# EAGLE design xbee_breakout (EAGLE 9.5.1)
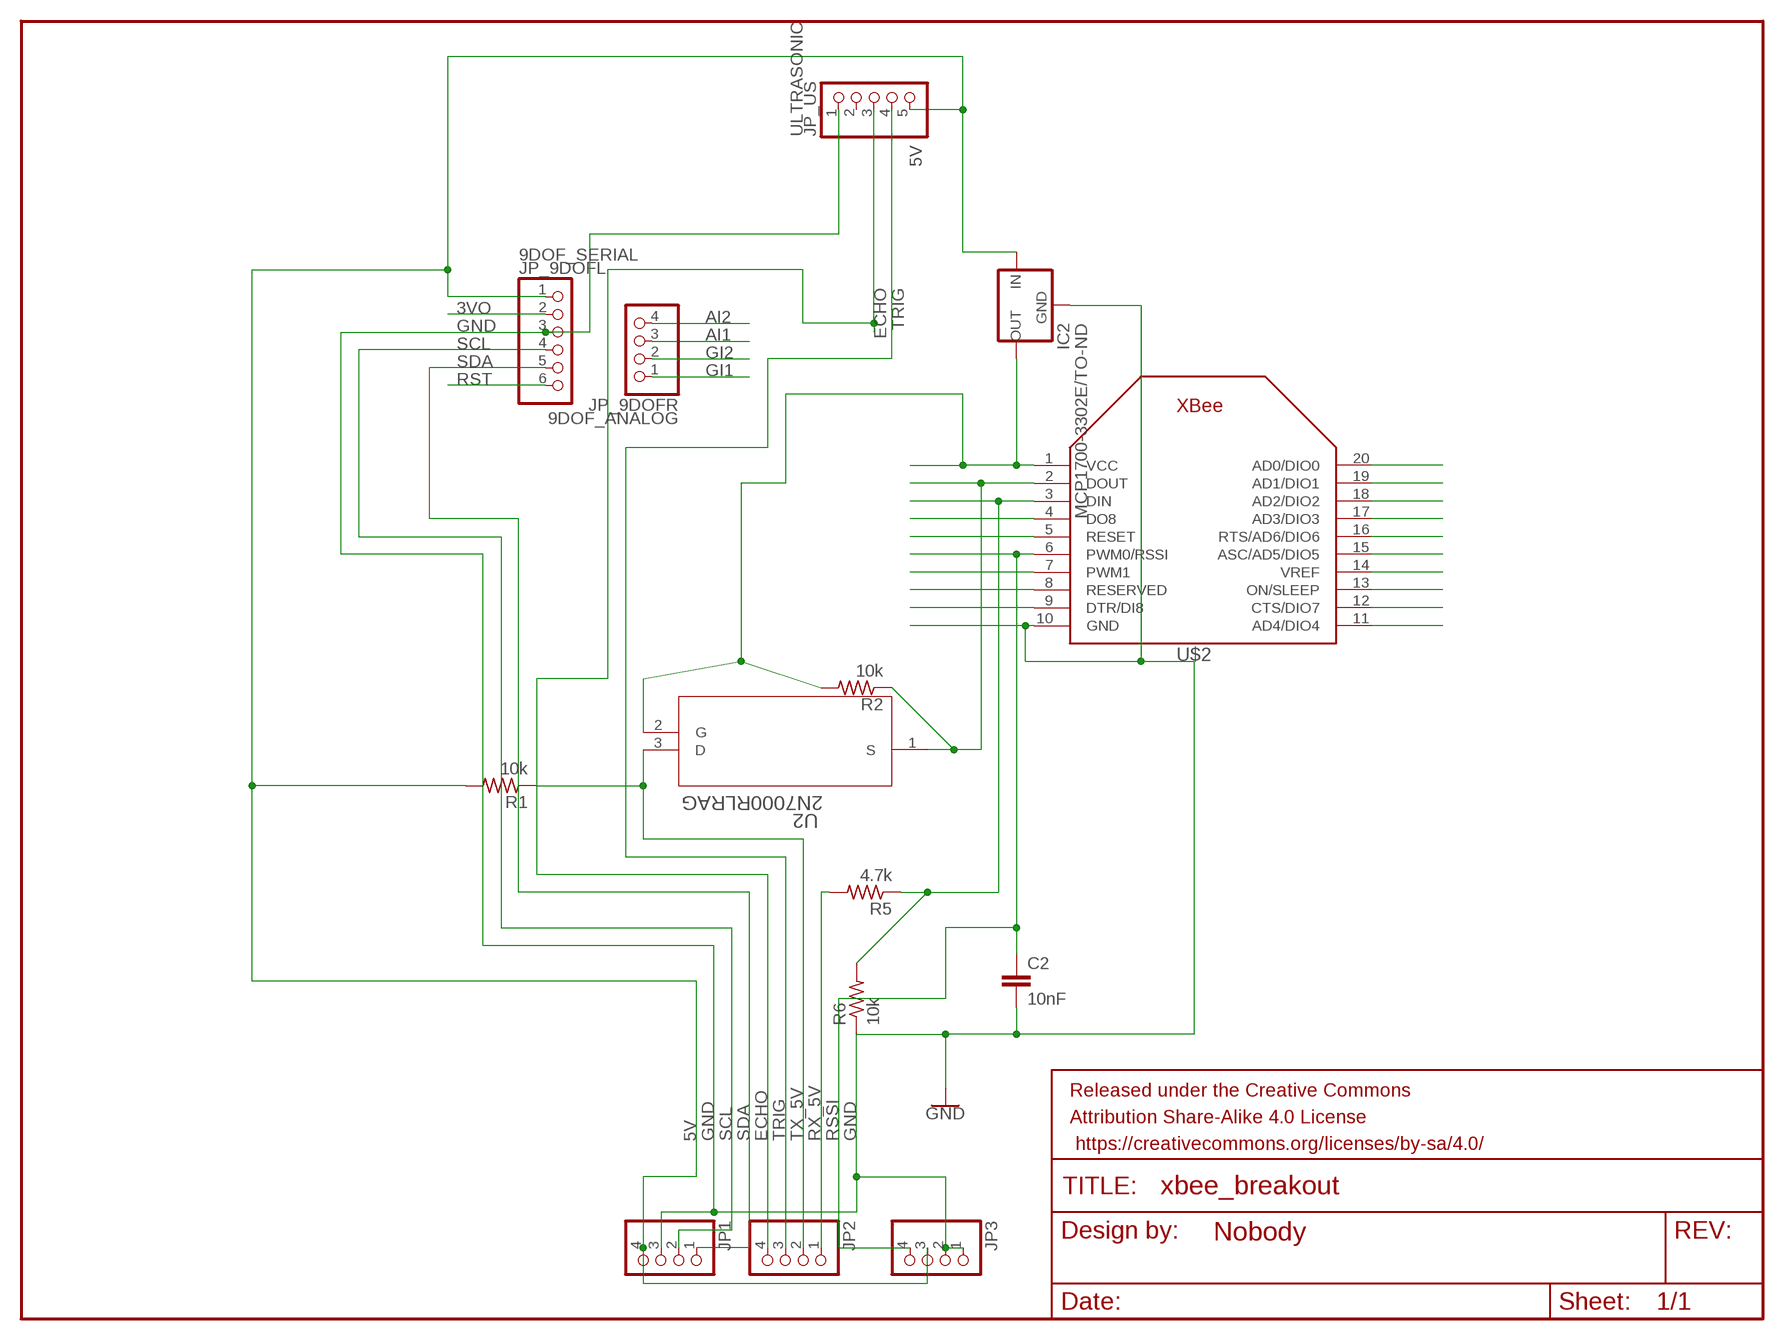
[diagram p0: schematic, sheet 1]

## Parts
C2  10nF  10NF-PTH-10MM-10000V-1-%  [CAP-PTH-10MM]
FRAME1  FRAME-LETTERNO_PACKAGE  [DUMMY]
IC2  MCP1700-3302E/TO-ND  MCP1700INLINE  [TO92-INLINE]
JP1  PINHD-1X4  [1X04]
JP2  PINHD-1X4  [1X04]
JP3  PINHD-1X4  [1X04]
JP_9DOFL  PINHD-1X6  [1X06]
JP_9DOFR  PINHD-1X4  [1X04]
JP_US  PINHD-1X5  [1X05]
R1  10k  R-US_0207/12  [0207/12]
R2  10k  R-US_0207/12  [0207/12]
R5  4.7k  R-US_0207/12  [0207/12]
R6  10k  R-US_0207/12  [0207/12]
U2  2N7000RLRAG  [TO-92]
U$2  XBEE  [XBEE]

## Nets
3VO: JP_9DOFL.2
5V: IC2.2(IN) JP1.4 JP3.3 JP_9DOFL.1 JP_US.5 R1.2
AI1: JP_9DOFR.3
AI2: JP_9DOFR.4
DIN: R5.1 R6.2 U$2.3(DIN)
DOUT: R2.1 U2.1(S) U$2.2(DOUT)
ECHO: JP2.4 JP_US.3
GI1: JP_9DOFR.1
GI2: JP_9DOFR.2
GND: C2.2 IC2.1(GND) JP1.3 JP3.1 JP3.2 JP_9DOFL.3 JP_US.1 R6.1 U$2.10(GND)
N$2: U$2.8(RESERVED)
N$29: U$2.20(AD0/DIO0)
N$37: U$2.19(AD1/DIO1)
N$38: U$2.18(AD2/DIO2)
N$39: U$2.17(AD3/DIO3)
N$40: U$2.16(RTS/AD6/DIO6)
N$41: U$2.15(ASC/AD5/DIO5)
N$42: U$2.14(VREF)
N$43: U$2.13(ON/SLEEP)
N$44: U$2.12(CTS/DIO7)
N$45: U$2.11(AD4/DIO4)
N$46: U$2.9(DTR/DI8)
N$47: U$2.7(PWM1)
N$49: U$2.5(RESET)
N$50: U$2.4(DO8)
RSSI: C2.1 JP3.4 U$2.6(PWM0/RSSI)
RST: JP_9DOFL.6
RX_5V: JP2.1 R5.2
SCL: JP1.2 JP_9DOFL.4
SDA: JP1.1 JP_9DOFL.5
TRIG: JP2.3 JP_US.4
TX_5V: JP2.2 R1.1 U2.3(D)
VCC: IC2.3(OUT) R2.2 U2.2(G) U$2.1(VCC)
Unconnected: JP_US.2

## Library data of the parts
C2 = SparkFun-Capacitors:10NF: 0.01uF/10nF/10,000pF ceramic capacitors A capacitor is a passive two-terminal electrical component used to store electrical energy temporarily in an electric field. CAP-09321; PROD_ID: CAP-09321
FRAME1 = SparkFun-Aesthetics:FRAME-LETTER: Schematic Frame - Letter Standard 8.5x11 US Letter frame; DESIGNER: Nobody; VERSION: v01
IC2 = adafruit:MCP1700: VOLTAGE REGULATOR
JP1-JP3 JP_9DOFR = pinhead:PINHD-1X4: PIN HEADER
JP_9DOFL = pinhead:PINHD-1X6: PIN HEADER
JP_US = pinhead:PINHD-1X5: PIN HEADER
R1 R2 R5 R6 = resistor:R-US_: RESISTOR, American symbol
U2 = 2N7000RLRAG:2N7000RLRAG; BUILT_BY: EMA_UL_Team; MANUFACTURER_PART_NUMBER: 2N7000RLRAG; VENDOR: ON Semiconductor
U$2 = adafruit:XBEE

## Board
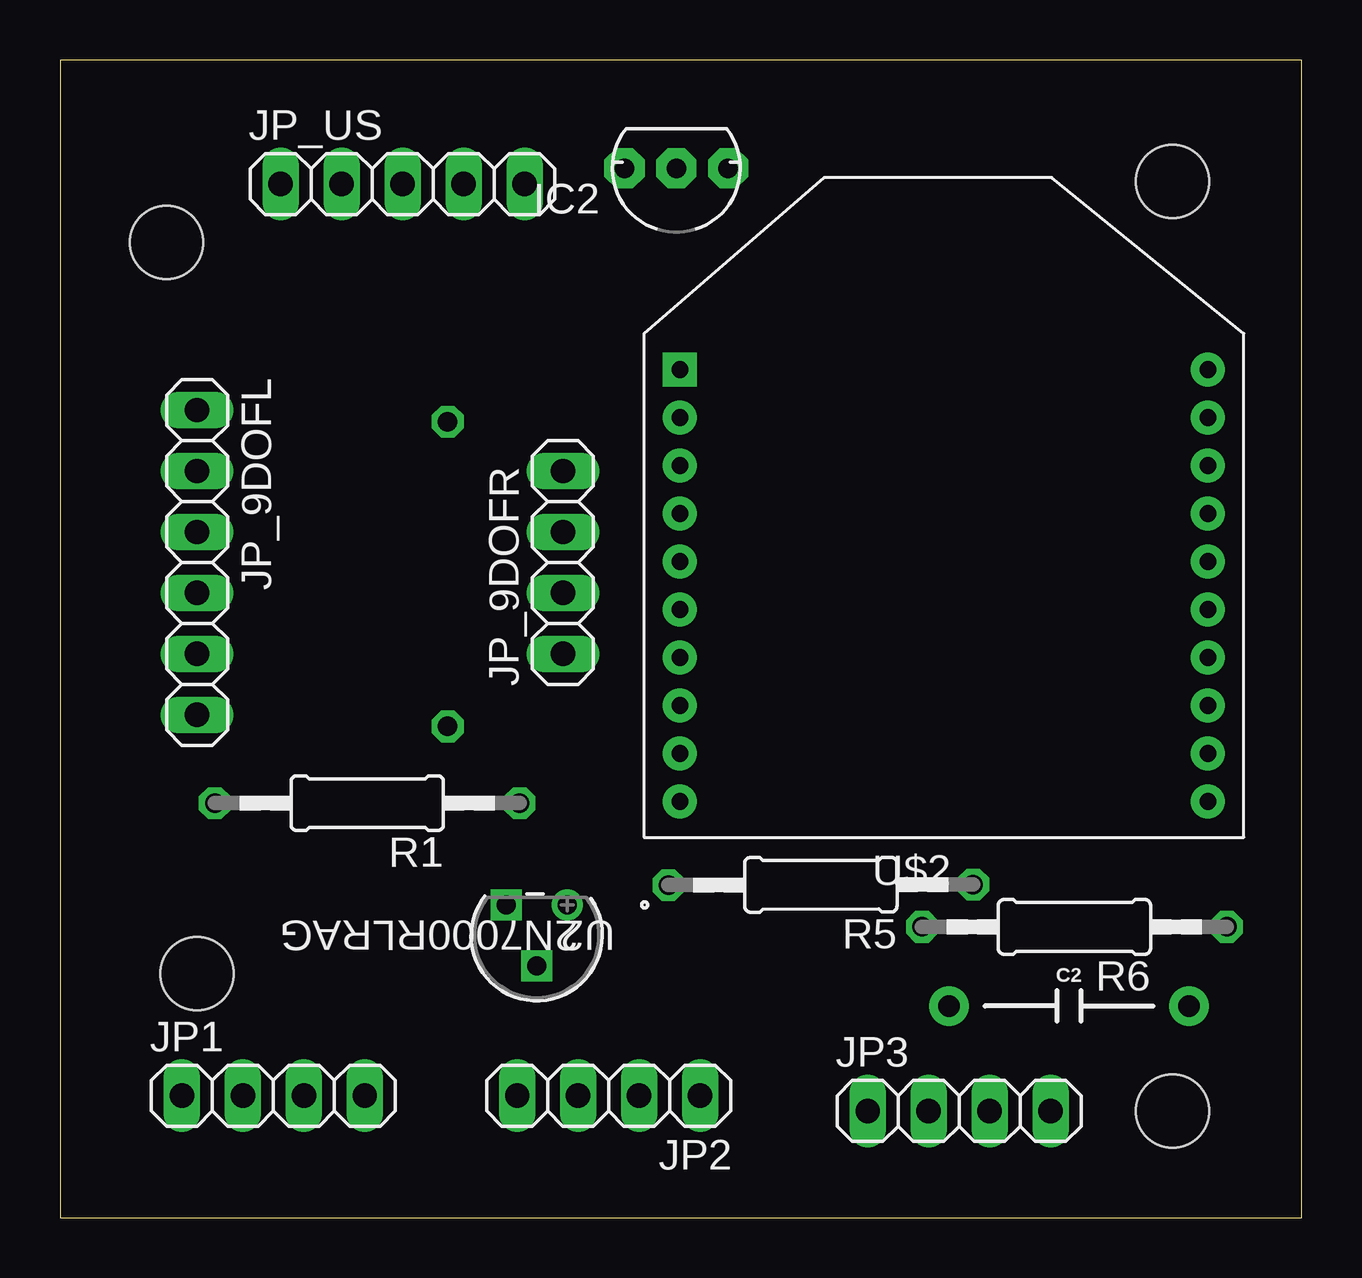
[diagram p1: board, top side]
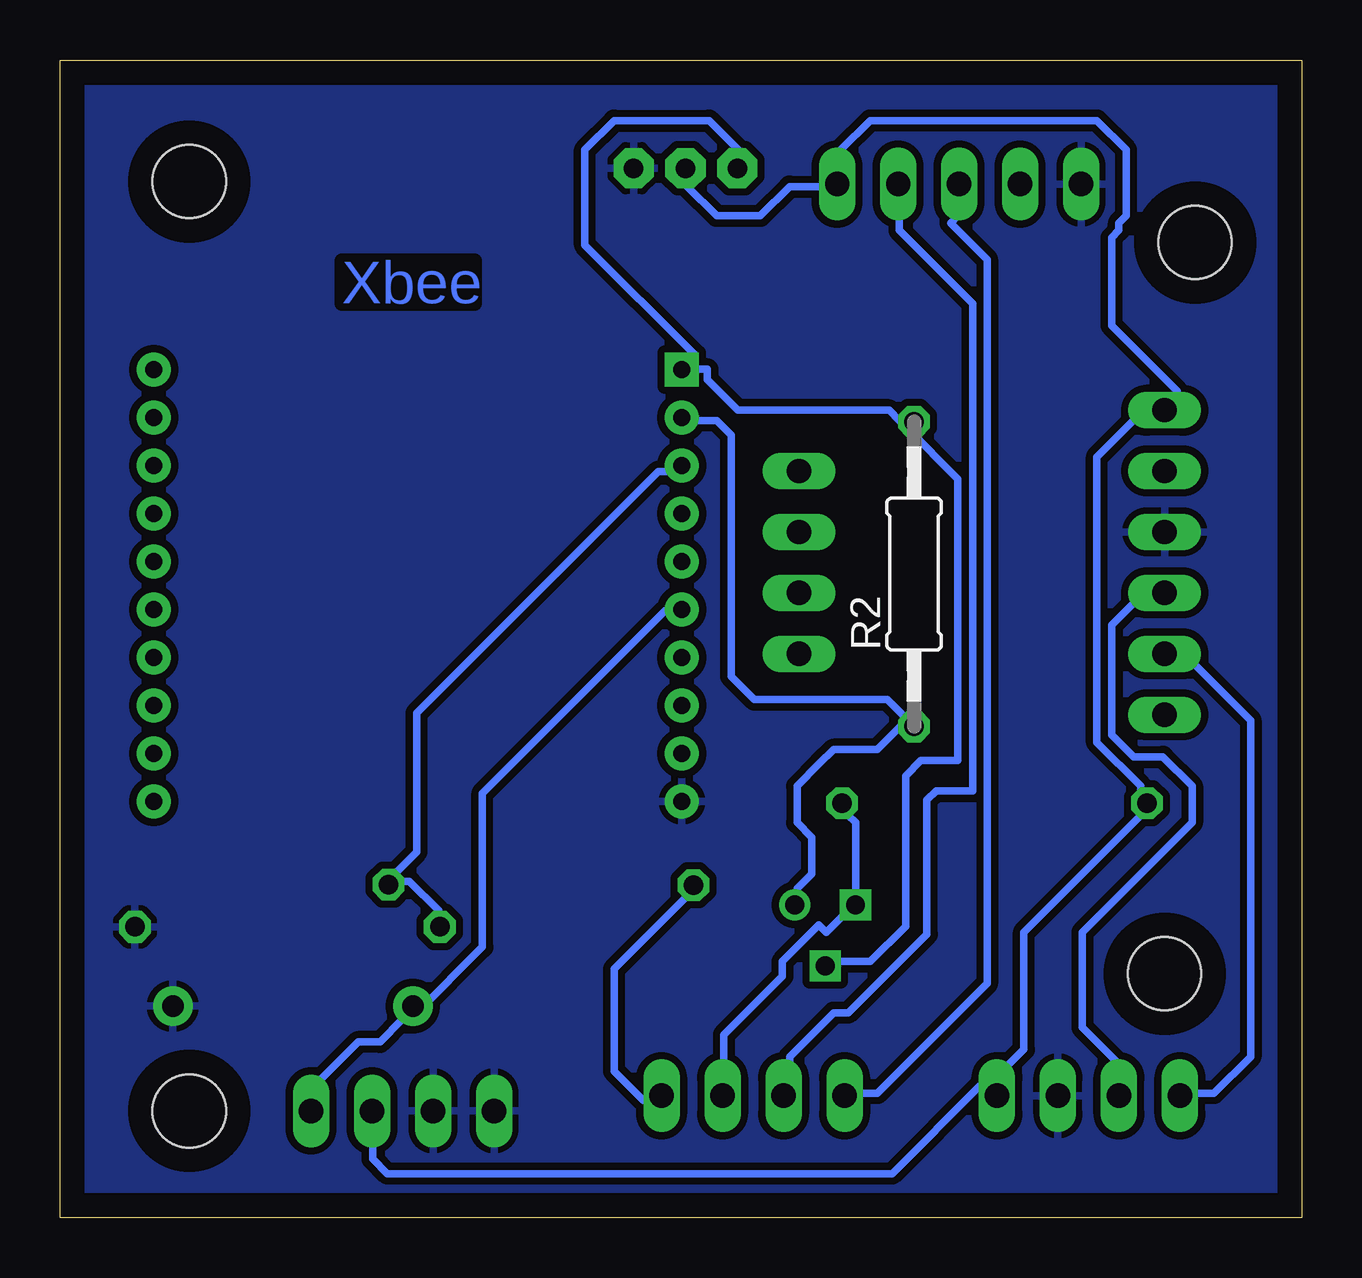
[diagram p2: board, bottom side, seen from below]

Size 51.74 x 48.25 mm. Coordinates in mm from the lower left corner, seen from the top.
Outline: 0,0 51.74,0 51.74,48.25 0,48.25 0,0
Copper layers (1*16): Top 0.035mm / dielectric 1.5mm / Bottom 0.035mm
Design rules "default *": minimum track width 12mil, minimum drill 20mil, track to track 12mil, track to pad 12mil, pad to pad 12mil, via to via 12mil, smd to smd 12mil, copper to edge 40mil, drill to drill 12mil, minimum pad ring 10mil, minimum via ring 8mil, stop-mask expansion 4mil, vias tented up to drill 0mil, thermal gap 10mil
Holes 3.05 mm at 46.35,43.18 5.71,10.16 46.35,4.45 4.45,40.64

### Footprints (pad centres in the part's own frame; a part is rotated, then mirrored left to right if it is on the bottom)
CAP-PTH-10MM = drill 0.9 pad 1.651: 1 -5,0; 2 5,0
TO92-INLINE = drill 0.813 pad 1.676 octagon: 1 -2.159,0; 2 0,0; 3 2.159,0
1X04 = drill 1.016 long: 1 -3.81,0; 2 -1.27,0; 3 1.27,0; 4 3.81,0
1X06 = drill 1.016 long: 1 -6.35,0; 2 -3.81,0; 3 -1.27,0; 4 1.27,0; 5 3.81,0; 6 6.35,0
1X05 = drill 1.016 long: 1 -5.08,0; 2 -2.54,0; 3 0,0; 4 2.54,0; 5 5.08,0
0207/12 = drill 0.813 octagon: 1 -6.35,0; 2 6.35,0
TO-92 = drill 0.787 pad 1.295: 1 -2.54,-2.54 | drill 0.787 pad 1.295 square: 2 -1.27,0; 3 0,-2.54
XBEE = drill 0.7 pad 1.422 square: 1 -11,5.5 | drill 0.7 pad 1.422: 2 -11,3.5; 3 -11,1.5; 4 -11,-0.5; 5 -11,-2.5; 6 -11,-4.5; 7 -11,-6.5; 8 -11,-8.5; 9 -11,-10.5; 10 -11,-12.5; 11 11,-12.5; 12 11,-10.5; 13 11,-8.5; 14 11,-6.5; 15 11,-4.5; 16 11,-2.5; 17 11,-0.5; 18 11,1.5; 19 11,3.5; 20 11,5.5

### Placement (x,y rotation side)
C2  42.04,8.81 0 top
FRAME1  -26.67,67.31 0 top  (outside the outline)
IC2  25.68,43.74 180 top
JP1  8.89,5.08 0 top
JP2  22.86,5.08 180 top
JP3  37.47,4.45 0 top
JP_9DOFL  5.71,27.3 270 top
JP_9DOFR  20.95,27.3 90 top
JP_US  14.27,43.08 0 top
R1  12.8,17.27 180 top
R2  16.15,26.82 90 bottom
R5  31.7,13.87 180.1 top
R6  42.27,12.12 180 top
U2  18.59,10.49 180 top
U$2  36.83,29.84 0 top

### Tracks (layer width: path | path; a pad name or v marks a point on that pad's centre or on a via)
5V
  Bottom 0.305: IC2.2 25.6,43.59 25.6,42.98 24.38,41.76 22.55,41.76 21.34,42.98 19.51,42.98 JP_US.5 19.2,43.28 19.2,44.5 17.98,45.72 8.53,45.72 7.32,44.5 7.32,41.76 7.62,41.45 7.62,41.15 7.92,40.84 7.92,37.19 5.18,34.44 5.18,34.14 5.49,33.83 JP_9DOFL.1 5.79,33.53 6.71,33.53 8.53,31.7 8.53,19.81 6.71,17.98 6.71,17.37 R1.2 6.71,17.07 6.71,16.76 11.58,11.89 11.58,7.01 12.5,6.1 12.5,5.49 | 12.5,5.49 12.5,5.18 JP1.4 12.5,5.49 | 12.5,5.49 13.41,5.49 17.07,1.83 38.1,1.83 38.71,2.44 38.71,4.27 JP3.3
DIN
  Bottom 0.305: R6.2 35.97,12.19 35.97,12.8 37.19,14.02 37.8,14.02 R5.1 38.1,14.02 36.88,15.24 36.88,21.03 26.82,31.09 25.91,31.09 U$2.3
DOUT
  Bottom 0.305: U2.1 21.03,13.11 21.03,13.72 20.42,14.33 20.42,15.85 21.03,16.46 21.03,17.98 20.12,18.9 19.51,19.51 17.68,19.51 16.76,20.42 16.15,20.42 R2.1 17.27,21.59 22.81,21.59 22.84,21.61 23.77,22.55 23.77,32.61 24.38,33.22 25.6,33.22 U$2.2
ECHO
  Bottom 0.305: JP2.4 18.9,5.18 17.68,5.18 13.11,9.75 13.11,39.93 14.63,41.45 14.33,41.76 14.33,42.98 JP_US.3
GND
  pour Bottom: 0,0 0,48.26 51.44,48.26 51.44,0
RSSI
  Bottom 0.305: 36.88,8.53 34.14,11.28 34.14,17.68 26.52,25.3 25.91,25.3 U$2.6 | 36.88,8.53 37.19,8.23 37.49,8.23 38.41,7.32 39.32,7.32 41.15,5.49 41.15,4.57 JP3.4 | 36.88,8.53 C2.1
RX_5V
  Bottom 0.305: R5.2 25.6,13.72 25.6,13.41 28.65,10.36 28.65,6.1 27.43,4.88 26.82,4.88 JP2.1
SCL
  Bottom 0.305: JP1.2 7.62,6.4 9.14,7.92 9.14,11.89 4.57,16.46 4.57,17.98 5.79,19.2 7.01,19.2 7.92,20.12 7.92,24.69 6.71,25.91 5.79,25.91 JP_9DOFL.4
SDA
  Bottom 0.305: JP1.1 4.88,5.18 3.66,5.18 2.13,6.71 2.13,20.73 4.88,23.47 5.49,23.47 JP_9DOFL.5
TRIG
  Bottom 0.305: JP2.3 21.34,5.18 21.34,6.71 19.51,8.53 18.9,8.53 15.62,11.81 15.62,17.4 15.24,17.78 13.72,17.78 13.72,38.1 16.76,41.15 16.76,42.98 JP_US.4
TX_5V
  Bottom 0.305: 18.59,13.11 18.59,16.46 18.9,16.76 19.2,16.76 19.2,17.07 R1.1 | 18.59,13.11 19.81,11.89 20.12,12.19 21.64,10.67 21.64,10.06 24.08,7.62 24.08,5.18 JP2.2 | 18.59,13.11 U2.3
VCC
  Bottom 0.305: 16.15,33.22 16.46,32.92 14.33,30.79 14.33,19.05 15.88,19.05 16.51,18.41 16.51,12.14 17.98,10.67 19.81,10.67 U2.2 | 25.3,35.36 24.77,35.36 24.77,34.92 23.5,33.66 17.2,33.66 16.76,33.22 16.15,33.22 | 25.3,35.36 25.6,35.36 U$2.1 25.3,35.36 | 16.15,33.22 R2.2 | 25.3,35.36 25.3,35.97 29.87,40.54 29.87,44.5 28.65,45.72 24.69,45.72 23.47,44.5 23.47,43.89 IC2.3

### Text on the board
Bottom: Xbee